# Altium schematic sheet INTERFACES.SchDoc
size 594 x 420 mm; SheetNumber: 6; SheetTotal: 6
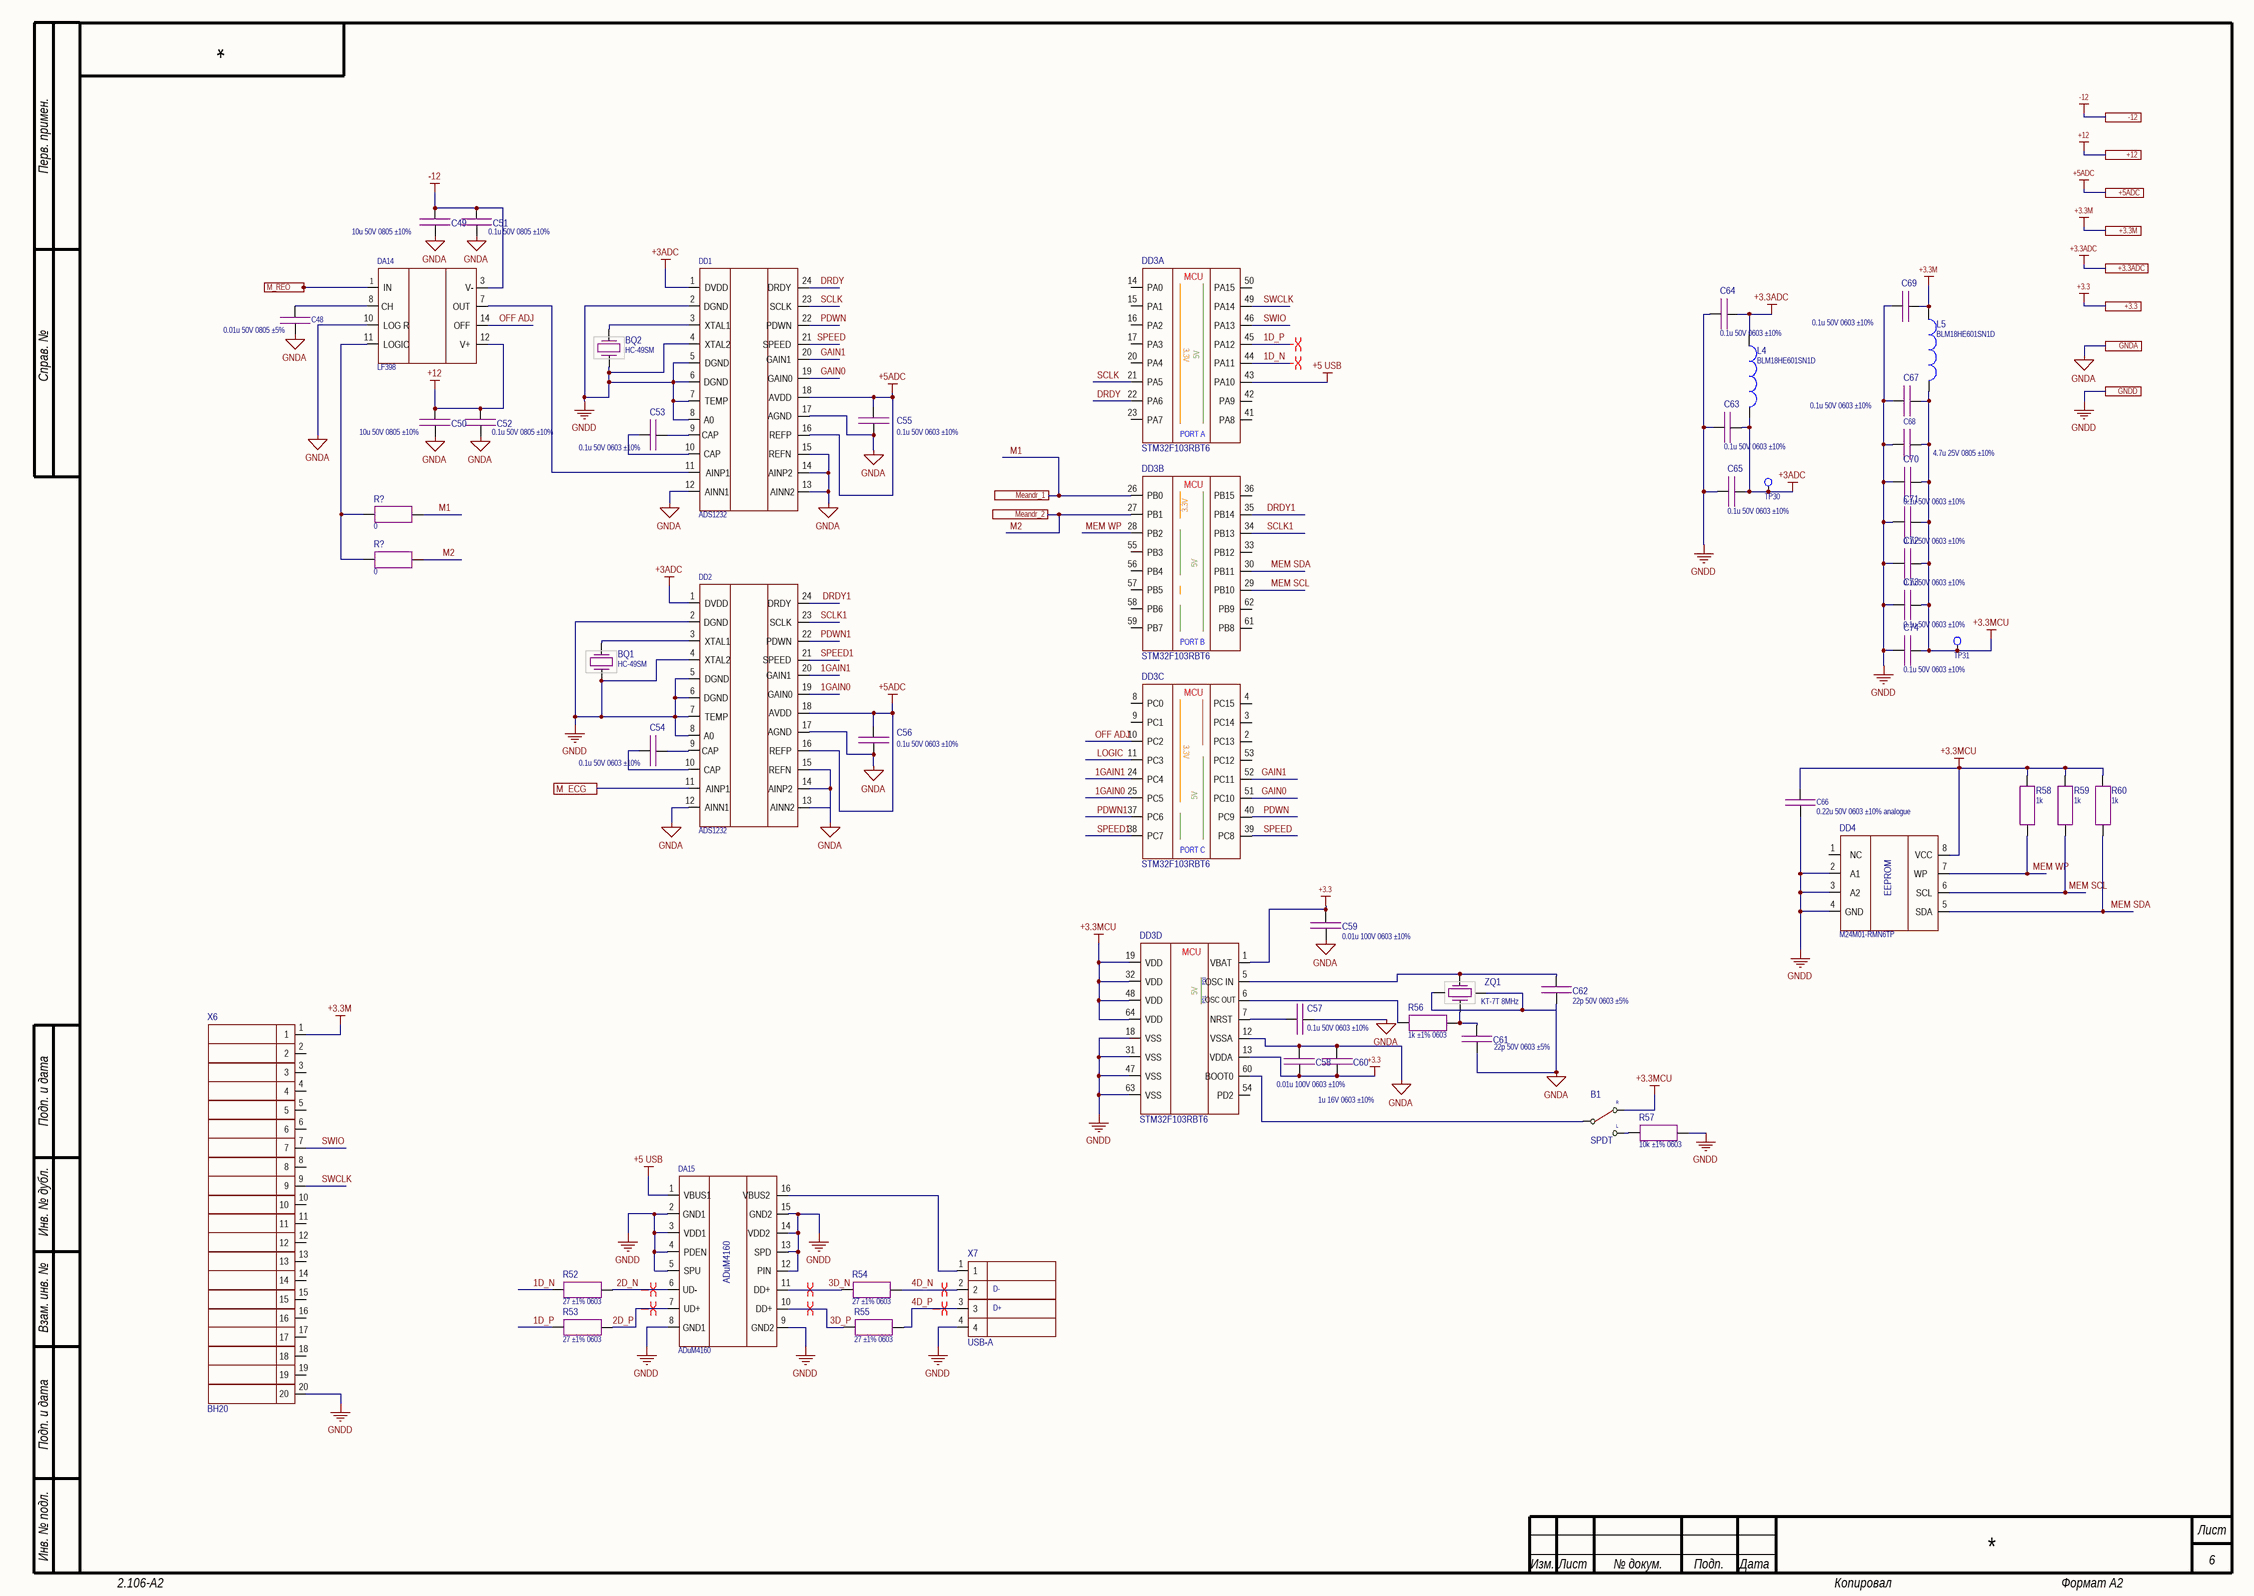
[diagram p0: INTERFACES.SchDoc]

## Parts
(Parts that share a designator on the sheet are numbered #1, #2 ... from top to bottom, then left to right.)
B1  SPDT  [Slide Switch 3 pin]
BQ1  HC-49SM  [CRYSTAL: HC-49SM]
BQ2  HC-49SM  [CRYSTAL: HC-49SM]
C48  0.01u 50V 0805 ±5%  [CAP: SMD 0805 MD IPC 782]
C49  10u 50V 0805 ±10%  [CAP: SMD 0805 MD IPC 782]
C50  10u 50V 0805 ±10%  [CAP: SMD 0805 MD IPC 782]
C51  0.1u 50V 0805 ±10%  [CAP: SMD 0805 MD IPC 782]
C52  0.1u 50V 0805 ±10%  [CAP: SMD 0805 MD IPC 782]
C53  0.1u 50V 0603 ±10%  [CAP: SMD 0603 MD IPC 782]
C54  0.1u 50V 0603 ±10%  [CAP: SMD 0603 MD IPC 782]
C55  0.1u 50V 0603 ±10%  [CAP: SMD 0603 MD IPC 782]
C56  0.1u 50V 0603 ±10%  [CAP: SMD 0603 MD IPC 782]
C57  0.1u 50V 0603 ±10%  [CAP: SMD 0603 MD IPC 782]
C58  0.01u 100V 0603 ±10%  [CAP: SMD 0603 MD IPC 782]
C59  0.01u 100V 0603 ±10%  [CAP: SMD 0603 MD IPC 782]
C60  1u 16V 0603 ±10%  [CAP: SMD 0603 MD IPC 782]
C61  22p 50V 0603 ±5%  [CAP: SMD 0603 MD IPC 782]
C62  22p 50V 0603 ±5%  [CAP: SMD 0603 MD IPC 782]
C63  0.1u 50V 0603 ±10%  [CAP: SMD 0603 MD IPC 782]
C64  0.1u 50V 0603 ±10%  [CAP: SMD 0603 MD IPC 782]
C65  0.1u 50V 0603 ±10%  [CAP: SMD 0603 MD IPC 782]
C66  0.22u 50V 0603 ±10% analogue  [CAP: SMD 0603 MD IPC 782]
C67  0.1u 50V 0603 ±10%  [CAP: SMD 0603 MD IPC 782]
C68  4.7u 25V 0805 ±10%  [CAP: SMD 0805 MD IPC 782]
C69  0.1u 50V 0603 ±10%  [CAP: SMD 0603 MD IPC 782]
C70  0.1u 50V 0603 ±10%  [CAP: SMD 0603 MD IPC 782]
C71  0.1u 50V 0603 ±10%  [CAP: SMD 0603 MD IPC 782]
C72  0.1u 50V 0603 ±10%  [CAP: SMD 0603 MD IPC 782]
C73  0.1u 50V 0603 ±10%  [CAP: SMD 0603 MD IPC 782]
C74  0.1u 50V 0603 ±10%  [CAP: SMD 0603 MD IPC 782]
DA14  LF398  [IC: SOIC 14]
DA15  ADuM4160  [IC: SOIC 16 WIDE]
DD1  ADS1232  [TSSOP-24]
DD2  ADS1232  [TSSOP-24]
DD3  STM32F103RBT6  [MC: LQFP-64]  (parts A,B,C,D of 4)
DD4  M24M01-RMN6TP  [IC: SOIC 8]
L4  BLM18HE601SN1D  [IND: SMD 0603 MD IPC 782]
L5  BLM18HE601SN1D  [IND: SMD 0603 MD IPC 782]
R52  27 ±1% 0603  [IND: SMD 0603 BLM18HE601SN1D]
R53  27 ±1% 0603  [IND: SMD 0603 BLM18HE601SN1D]
R54  27 ±1% 0603  [IND: SMD 0603 BLM18HE601SN1D]
R55  27 ±1% 0603  [IND: SMD 0603 BLM18HE601SN1D]
R56  1k ±1% 0603  [RES: SMD 0603 MD IPC 782]
R57  10k ±1% 0603  [RES: SMD 0603 MD IPC 782]
R58  1k  [RES: SMD 0603 MD IPC 782]
R59  1k  [RES: SMD 0603 MD IPC 782]
R60  1k  [RES: SMD 0603 MD IPC 782]
R?#1  0  [RES: SMD 0603 MD IPC 782]
R?#2  0  [RES: SMD 0603 MD IPC 782]
TP30  Test point  [Test Point]  (value not drawn)  (net tie)
TP31  Test point  [Test Point]  (value not drawn)  (net tie)
X6  BH20  [CON: BH-20]
X7  USB-A  [CON: 4PIN USB B]
ZQ1  KT-7T 8MHz  [CRYSTAL: 3225 4pin]

## Ports
+3.3 (see REO_ECG[2B], ECG[4A], POWER[1A]), +3.3ADC (see REO_ECG[2B], POWER[1A]), +3.3M (see REO_ECG[2B], POWER[1A]), +5ADC (see REO_ECG[2B], POWER[1A]), +12 (see REO_ECG[2B], ECG[4A], Generator_REO[1A], Measurement_REO[4A], POWER[1B]), -12 (see REO_ECG[2B], ECG[4A], Generator_REO[1B], Measurement_REO[4A], POWER[1B]), GNDA (see REO_ECG[2B]), GNDD (see REO_ECG[2B]), M_ECG (see REO_ECG[2B]), M_REO (see REO_ECG[2B]), Meandr_1 (see REO_ECG[2B]), Meandr_2 (see REO_ECG[2B])

## Nets
+3.3: C58.2 C59.1 C60.2 DD3.1(VBAT) DD3.13(VDDA) ; port +3.3
+3.3ADC: C64.2 L4.1 ; port +3.3ADC
+3.3M: C69.2 L5.1 X6.1 ; port +3.3M
+3.3MCU: B1.3 C66.1 C67.1 C68.1 C70.2 C71.2 C72.2 C73.2 C74.2 DD3.19(VDD) DD3.32(VDD) DD3.48(VDD) DD3.64(VDD) DD4.8(VCC) L5.2 R58.2 R59.2 R60.2 TP31.1
+3ADC: C63.1 C65.2 DD1.1(DVDD) DD2.1(DVDD) L4.2 TP30.1
+5 USB: DA15.1(VBUS1) DD3.43(PA10)
+5ADC: C55.1 C56.1 DD1.16(REFP) DD1.18(AVDD) DD2.16(REFP) DD2.18(AVDD) ; port +5ADC
+12: C50.1 C52.1 DA14.12(V+) ; port +12
-12: C49.1 C51.1 DA14.3(V-) ; port -12
GNDA: C48.2 C49.2 C50.2 C51.2 C52.2 C55.2 C56.2 C57.1 C58.1 C59.2 C60.1 C61.2 C62.2 DA14.10(LOG_R) DD1.12(AINN1) DD1.13(AINN2) DD1.14(AINP2) DD1.15(REFN) DD1.17(AGND) DD2.12(AINN1) DD2.13(AINN2) DD2.14(AINP2) DD2.15(REFN) DD2.17(AGND) DD3.12(VSSA) ZQ1.2 ZQ1.4 ; port GNDA
GNDD: BQ1.1 BQ2.1 C63.2 C64.1 C65.1 C66.2 C67.2 C68.2 C69.1 C70.1 C71.1 C72.1 C73.1 C74.1 DA15.2(GND1) DA15.3(VDD1) DA15.4(PDEN) DA15.5(SPU) DA15.8(GND1) DA15.9(GND2) DA15.12(PIN) DA15.13(SPD) DA15.14(VDD2) DA15.15(GND2) DD1.2(DGND) DD1.4(XTAL2) DD2.2(DGND) DD2.4(XTAL2) DD2.5(DGND) DD2.6(DGND) DD2.7(TEMP) DD2.8(A0) DD3.18(VSS) DD3.31(VSS) DD3.47(VSS) DD3.63(VSS) DD4.2(A1) DD4.3(A2) DD4.4(GND) R57.2 X6.20 X7.4 ; port GNDD
1D_N: DD3.44(PA11) R52.1
1D_P: DD3.45(PA12) R53.1
1GAIN0: DD2.19(GAIN0) DD3.25(PC5)
1GAIN1: DD2.20(GAIN1) DD3.24(PC4)
2D_N: DA15.6(UD-) R52.2
2D_P: DA15.7(UD+) R53.2
3D_N: DA15.11(DD+) R54.1
3D_P: DA15.10(DD+) R55.1
4D_N: R54.2 X7.2
4D_P: R55.2 X7.3
DRDY: DD1.24(DRDY) DD3.22(PA6)
DRDY1: DD2.24(DRDY) DD3.35(PB14)
GAIN0: DD1.19(GAIN0) DD3.51(PC10)
GAIN1: DD1.20(GAIN1) DD3.52(PC11)
LOGIC: DD3.11(PC3)
M1: DD3.26(PB0) R?#1.2 ; port Meandr_1
M2: DD3.27(PB1) R?#2.2 ; port Meandr_2
M_ECG: DD2.11(AINP1) ; port M_ECG
M_REO: DA14.1(IN) ; port M_REO
MEM SCL: DD3.29(PB10) DD4.6(SCL) R59.1
MEM SDA: DD3.30(PB11) DD4.5(SDA) R60.1
MEM WP: DD3.28(PB2) DD4.7(WP) R58.1
OFF ADJ: DA14.14(OFF) DD3.10(PC2)
PDWN: DD1.22(PDWN) DD3.40(PC9)
PDWN1: DD2.22(PDWN) DD3.37(PC6)
SCLK: DD1.23(SCLK) DD3.21(PA5)
SCLK1: DD2.23(SCLK) DD3.34(PB13)
SPEED: DD1.21(SPEED) DD3.39(PC8)
SPEED1: DD2.21(SPEED) DD3.38(PC7)
SWCLK: DD3.49(PA14) X6.9
SWIO: DD3.46(PA13) X6.7
NetB1_1: B1.1 R57.1
NetB1_2: B1.2 DD3.60(BOOT0)
NetBQ1_2: BQ1.2 DD2.3(XTAL1)
NetBQ2_2: BQ2.2 DD1.3(XTAL1)
NetC48_1: C48.1 DA14.8(CH)
NetC53_1: C53.1 DD1.9(CAP)
NetC53_2: C53.2 DD1.10(CAP)
NetC54_1: C54.1 DD2.9(CAP)
NetC54_2: C54.2 DD2.10(CAP)
NetC57_2: C57.2 DD3.7(NRST)
NetC61_1: C61.1 R56.2 ZQ1.1
NetC62_1: C62.1 DD3.5(OSC_IN) ZQ1.3
NetDA14_7: DA14.7(OUT) DD1.11(AINP1)
NetDA14_11: DA14.11(LOGIC) R?#1.1 R?#2.1
NetDA15_16: DA15.16(VBUS2) X7.1
NetDD1_5: DD1.5(DGND) DD1.6(DGND) DD1.7(TEMP) DD1.8(A0)
NetDD3_6: DD3.6(OSC_OUT) R56.1

Not connected (* = marked no-connect by the designer): DD3 2(PC13) 3(PC14) 4(PC15) 8(PC0) 9(PC1) 14(PA0) 15(PA1) 16(PA2) 17(PA3) 20(PA4) 23(PA7) 33(PB12) 36(PB15) 41(PA8) 42(PA9) 50(PA15) 53(PC12) 54(PD2) 55(PB3) 56(PB4) 57(PB5) 58(PB6) 59(PB7) 61(PB8) 62(PB9); DD4 1(NC); X6 2 3 4 5 6 8 10 11 12 13 14 15 16 17 18 19

## Layout directives
differential pair: 1D_N, 1D_P, 2D_N, 2D_P, 3D_N, 3D_P, 4D_N, 4D_P

## Notes on the sheet
- (near X7) D-
- (near X7) D+
- Перв. примен.
- Справ. №
- Подп. и дата
- Инв. № дубл.
- Взам. инв. №
- Инв. № подл.
- Изм.
- Лист
- № докум.
- Подп.
- Дата
- 2.106-A2
- Копировал
- Формат А2
- (in symbol 128Kb I2C 1MHz) EEPROM
- (in symbol Slide switch SPDT) R; L
- (in symbol STM32F103 lqfp64 64kb, part A) MCU; 3.3V; 5V; PORT A
- (in symbol STM32F103 lqfp64 64kb, part B) MCU; 3.3V; 5V; PORT B
- (in symbol STM32F103 lqfp64 64kb, part C) MCU; 3.3V; 5V; PORT C
- (in symbol STM32F103 lqfp64 64kb, part D) MCU; PD0; 5V; PD1

## Library data of the parts
B1 = Slide switch SPDT: Code: -; Name: -
BQ1 BQ2 = SMD 4.9152MHz 2pin 10.3x4.5 16pF_1: Name: Резонатор кварцевый HC49SM 7.3728 MHz; Code: 6321974907; Parameter 1: 7.3728 MHz
C48 = 0.01u 50V 0805 ±5%: Code: 6279261451; Name: Конденсатор X7R 50V  0,01uF±5%  0805
C49 C50 = 10u 50V 0805 ±10%: Code: 6289735441; Name: Конденсатор 12065D106KAT2A, AVX
C51 C52 = 0.1u 50V 0805 ±10%: Code: 6279254871; Name: Конденсатор X7R 50V 0,1uF ±10% 0805
C53-C57 C63-C65 C67 C69-C74 = 0.1u 50V 0603 ±10%: CC0603KRX7R9BB104; Code: 6279259871; Name: Конденсатор X7R 50V 0,1uF +-10% 0603
C58 C59 = 0.01u 100V 0603 ±10%: Code: 6270003321; Name: Конденсатор СС0603KRX7R0BB104, Yageo
C60 = 1u 16V 0603 ±10%: Code: 62193105441; Name: Конденсатор 0603-NPO-25В-1000
C61 C62 = 22p 50V 0603 ±5%: Code: 6219310401; Name: Конденсатор 0603CG220J500NT, Fenghua
C66 = 0.22u 50V 0603 ±10% analogue: Code: 6270001221; Name: Конденсатор X7R 50V 0,22uF±10% 0603
C68 = 4.7u 25V 0805 ±10%: Code: 6270000501; Name: Конденсатор X7R 25V 4,7uF±10% 0805
DA14 = LF398MX
DA15 = USB ADuM4160: Name: Микросхема ADuM4160
DD3 = STM32F103 lqfp64 64kb: Code: 6335530806; Name: Микросхема STM32F103RBT6
DD4 = 128Kb I2C 1MHz: Code: 6339110311; Name: Микросхема M24M01-RMN6TP, ST
L4 L5 = 600Ohm 0,8A: Code: 6310011671; Name: Дроссель BLM18HE601SN1D, Murata
R52-R55 = 27 ±1% 0603: Code: 6069180381; Name: Резистор 27R±1% 0603
R56 = 1k ±1% 0603: Code: 6069174188; Name: Резистор 1k ±1% 0603
R57 = 10k ±1% 0603: Code: 6069191961; Name: Резистор 10K+-1% TK50 0603
R58-R60 = 1k ±1%: Code: 6069174188; Name: Резистор 1k ±1% 0603
R?#1 R?#2 = 0 ±5%: Code: 6020004221; Name: Резистор RC0603JR-070RL, Yageo
X6 = 20 pin IDC BH20 2.54: Code: 6313922720; Name: Вилка BH-20 Импорт
X7 = 4 pin USB
ZQ1 = SMD 8MHz 4pin 3.2x2.5 22pF: Code: 6329545441; Name: Резонатор кварцевый KT-7X 8.0 MHz